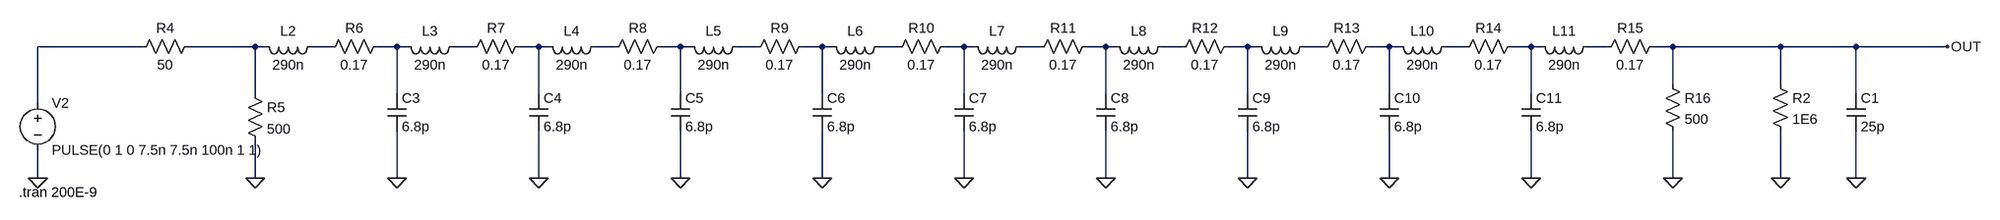
[diagram p0: schematic 10 cell_Ro.asc]
10 cell_Ro.asc, the LTspice schematic file:
Version 4
SHEET 1 1732 680
WIRE -1488 -480 -1664 -480
WIRE -1296 -480 -1408 -480
WIRE -1280 -480 -1296 -480
WIRE -1168 -480 -1200 -480
WIRE -1056 -480 -1088 -480
WIRE -1040 -480 -1056 -480
WIRE -928 -480 -960 -480
WIRE -816 -480 -848 -480
WIRE -800 -480 -816 -480
WIRE -688 -480 -720 -480
WIRE -576 -480 -608 -480
WIRE -560 -480 -576 -480
WIRE -448 -480 -480 -480
WIRE -336 -480 -368 -480
WIRE -320 -480 -336 -480
WIRE -208 -480 -240 -480
WIRE -96 -480 -128 -480
WIRE -80 -480 -96 -480
WIRE 32 -480 0 -480
WIRE 144 -480 112 -480
WIRE 160 -480 144 -480
WIRE 272 -480 240 -480
WIRE 384 -480 352 -480
WIRE 400 -480 384 -480
WIRE 512 -480 480 -480
WIRE 624 -480 592 -480
WIRE 640 -480 624 -480
WIRE 752 -480 720 -480
WIRE 864 -480 832 -480
WIRE 880 -480 864 -480
WIRE 992 -480 960 -480
WIRE 1104 -480 1072 -480
WIRE 1328 -480 1104 -480
WIRE 1456 -480 1328 -480
WIRE 1664 -480 1456 -480
WIRE 1104 -416 1104 -480
WIRE 1328 -416 1328 -480
WIRE -1296 -400 -1296 -480
WIRE -1056 -400 -1056 -480
WIRE -816 -400 -816 -480
WIRE -576 -400 -576 -480
WIRE -336 -400 -336 -480
WIRE -96 -400 -96 -480
WIRE 144 -400 144 -480
WIRE 384 -400 384 -480
WIRE 624 -400 624 -480
WIRE 864 -400 864 -480
WIRE 1456 -400 1456 -480
WIRE -1664 -384 -1664 -480
WIRE -1664 -256 -1664 -304
WIRE -1296 -256 -1296 -320
WIRE -1056 -256 -1056 -336
WIRE -816 -256 -816 -336
WIRE -576 -256 -576 -336
WIRE -336 -256 -336 -336
WIRE -96 -256 -96 -336
WIRE 144 -256 144 -336
WIRE 384 -256 384 -336
WIRE 624 -256 624 -336
WIRE 864 -256 864 -336
WIRE 1104 -256 1104 -336
WIRE 1328 -256 1328 -336
WIRE 1456 -256 1456 -336
FLAG -1664 -256 0
FLAG -1296 -256 0
FLAG -1056 -256 0
FLAG -816 -256 0
FLAG -576 -256 0
FLAG -336 -256 0
FLAG -96 -256 0
FLAG 144 -256 0
FLAG 384 -256 0
FLAG 624 -256 0
FLAG 864 -256 0
FLAG 1104 -256 0
FLAG 1328 -256 0
FLAG 1456 -256 0
FLAG 1664 -480 OUT
SYMBOL voltage -1664 -400 R0
WINDOW 123 0 0 Left 0
WINDOW 39 0 0 Left 0
SYMATTR InstName V2
SYMATTR Value PULSE(0 1 0 7.5n 7.5n 100n 1 1)
SYMBOL res -1392 -496 R90
WINDOW 0 0 56 VBottom 2
WINDOW 3 32 56 VTop 2
SYMATTR InstName R4
SYMATTR Value 50
SYMBOL res -1312 -416 R0
SYMATTR InstName R5
SYMATTR Value 500
SYMBOL ind -1184 -496 R90
WINDOW 0 5 56 VBottom 2
WINDOW 3 32 56 VTop 2
SYMATTR InstName L2
SYMATTR Value 290n
SYMBOL res -1072 -496 R90
WINDOW 0 0 56 VBottom 2
WINDOW 3 32 56 VTop 2
SYMATTR InstName R6
SYMATTR Value 0.17
SYMBOL cap -1072 -400 R0
SYMATTR InstName C3
SYMATTR Value 6.8p
SYMBOL ind -944 -496 R90
WINDOW 0 5 56 VBottom 2
WINDOW 3 32 56 VTop 2
SYMATTR InstName L3
SYMATTR Value 290n
SYMBOL res -832 -496 R90
WINDOW 0 0 56 VBottom 2
WINDOW 3 32 56 VTop 2
SYMATTR InstName R7
SYMATTR Value 0.17
SYMBOL cap -832 -400 R0
SYMATTR InstName C4
SYMATTR Value 6.8p
SYMBOL ind -704 -496 R90
WINDOW 0 5 56 VBottom 2
WINDOW 3 32 56 VTop 2
SYMATTR InstName L4
SYMATTR Value 290n
SYMBOL res -592 -496 R90
WINDOW 0 0 56 VBottom 2
WINDOW 3 32 56 VTop 2
SYMATTR InstName R8
SYMATTR Value 0.17
SYMBOL cap -592 -400 R0
SYMATTR InstName C5
SYMATTR Value 6.8p
SYMBOL ind -464 -496 R90
WINDOW 0 5 56 VBottom 2
WINDOW 3 32 56 VTop 2
SYMATTR InstName L5
SYMATTR Value 290n
SYMBOL res -352 -496 R90
WINDOW 0 0 56 VBottom 2
WINDOW 3 32 56 VTop 2
SYMATTR InstName R9
SYMATTR Value 0.17
SYMBOL cap -352 -400 R0
SYMATTR InstName C6
SYMATTR Value 6.8p
SYMBOL ind -224 -496 R90
WINDOW 0 5 56 VBottom 2
WINDOW 3 32 56 VTop 2
SYMATTR InstName L6
SYMATTR Value 290n
SYMBOL res -112 -496 R90
WINDOW 0 0 56 VBottom 2
WINDOW 3 32 56 VTop 2
SYMATTR InstName R10
SYMATTR Value 0.17
SYMBOL cap -112 -400 R0
SYMATTR InstName C7
SYMATTR Value 6.8p
SYMBOL ind 16 -496 R90
WINDOW 0 5 56 VBottom 2
WINDOW 3 32 56 VTop 2
SYMATTR InstName L7
SYMATTR Value 290n
SYMBOL res 128 -496 R90
WINDOW 0 0 56 VBottom 2
WINDOW 3 32 56 VTop 2
SYMATTR InstName R11
SYMATTR Value 0.17
SYMBOL cap 128 -400 R0
SYMATTR InstName C8
SYMATTR Value 6.8p
SYMBOL ind 256 -496 R90
WINDOW 0 5 56 VBottom 2
WINDOW 3 32 56 VTop 2
SYMATTR InstName L8
SYMATTR Value 290n
SYMBOL res 368 -496 R90
WINDOW 0 0 56 VBottom 2
WINDOW 3 32 56 VTop 2
SYMATTR InstName R12
SYMATTR Value 0.17
SYMBOL cap 368 -400 R0
SYMATTR InstName C9
SYMATTR Value 6.8p
SYMBOL ind 496 -496 R90
WINDOW 0 5 56 VBottom 2
WINDOW 3 32 56 VTop 2
SYMATTR InstName L9
SYMATTR Value 290n
SYMBOL res 608 -496 R90
WINDOW 0 0 56 VBottom 2
WINDOW 3 32 56 VTop 2
SYMATTR InstName R13
SYMATTR Value 0.17
SYMBOL cap 608 -400 R0
SYMATTR InstName C10
SYMATTR Value 6.8p
SYMBOL ind 736 -496 R90
WINDOW 0 5 56 VBottom 2
WINDOW 3 32 56 VTop 2
SYMATTR InstName L10
SYMATTR Value 290n
SYMBOL res 848 -496 R90
WINDOW 0 0 56 VBottom 2
WINDOW 3 32 56 VTop 2
SYMATTR InstName R14
SYMATTR Value 0.17
SYMBOL cap 848 -400 R0
SYMATTR InstName C11
SYMATTR Value 6.8p
SYMBOL ind 976 -496 R90
WINDOW 0 5 56 VBottom 2
WINDOW 3 32 56 VTop 2
SYMATTR InstName L11
SYMATTR Value 290n
SYMBOL res 1088 -496 R90
WINDOW 0 0 56 VBottom 2
WINDOW 3 32 56 VTop 2
SYMATTR InstName R15
SYMATTR Value 0.17
SYMBOL res 1088 -432 R0
SYMATTR InstName R16
SYMATTR Value 500
SYMBOL res 1312 -432 R0
SYMATTR InstName R2
SYMATTR Value 1E6
SYMBOL cap 1440 -400 R0
SYMATTR InstName C1
SYMATTR Value 25p
TEXT -1696 -232 Left 2 !.tran 200E-9

The netlist it stands for:
* 10 cell_Ro.asc
V2 N001 0 PULSE(0 1 0 7.5n 7.5n 100n 1 1)
R4 N002 N001 50
R5 N002 0 500
L2 N003 N002 290n
R6 N004 N003 0.17
C3 N004 0 6.8p
L3 N005 N004 290n
R7 N006 N005 0.17
C4 N006 0 6.8p
L4 N007 N006 290n
R8 N008 N007 0.17
C5 N008 0 6.8p
L5 N009 N008 290n
R9 N010 N009 0.17
C6 N010 0 6.8p
L6 N011 N010 290n
R10 N012 N011 0.17
C7 N012 0 6.8p
L7 N013 N012 290n
R11 N014 N013 0.17
C8 N014 0 6.8p
L8 N015 N014 290n
R12 N016 N015 0.17
C9 N016 0 6.8p
L9 N017 N016 290n
R13 N018 N017 0.17
C10 N018 0 6.8p
L10 N019 N018 290n
R14 N020 N019 0.17
C11 N020 0 6.8p
L11 N021 N020 290n
R15 OUT N021 0.17
R16 OUT 0 500
R2 OUT 0 1E6
C1 OUT 0 25p
.tran 200E-9
.backanno
.end